# EAGLE design pixelinmyclosedetch (EAGLE 5.07)
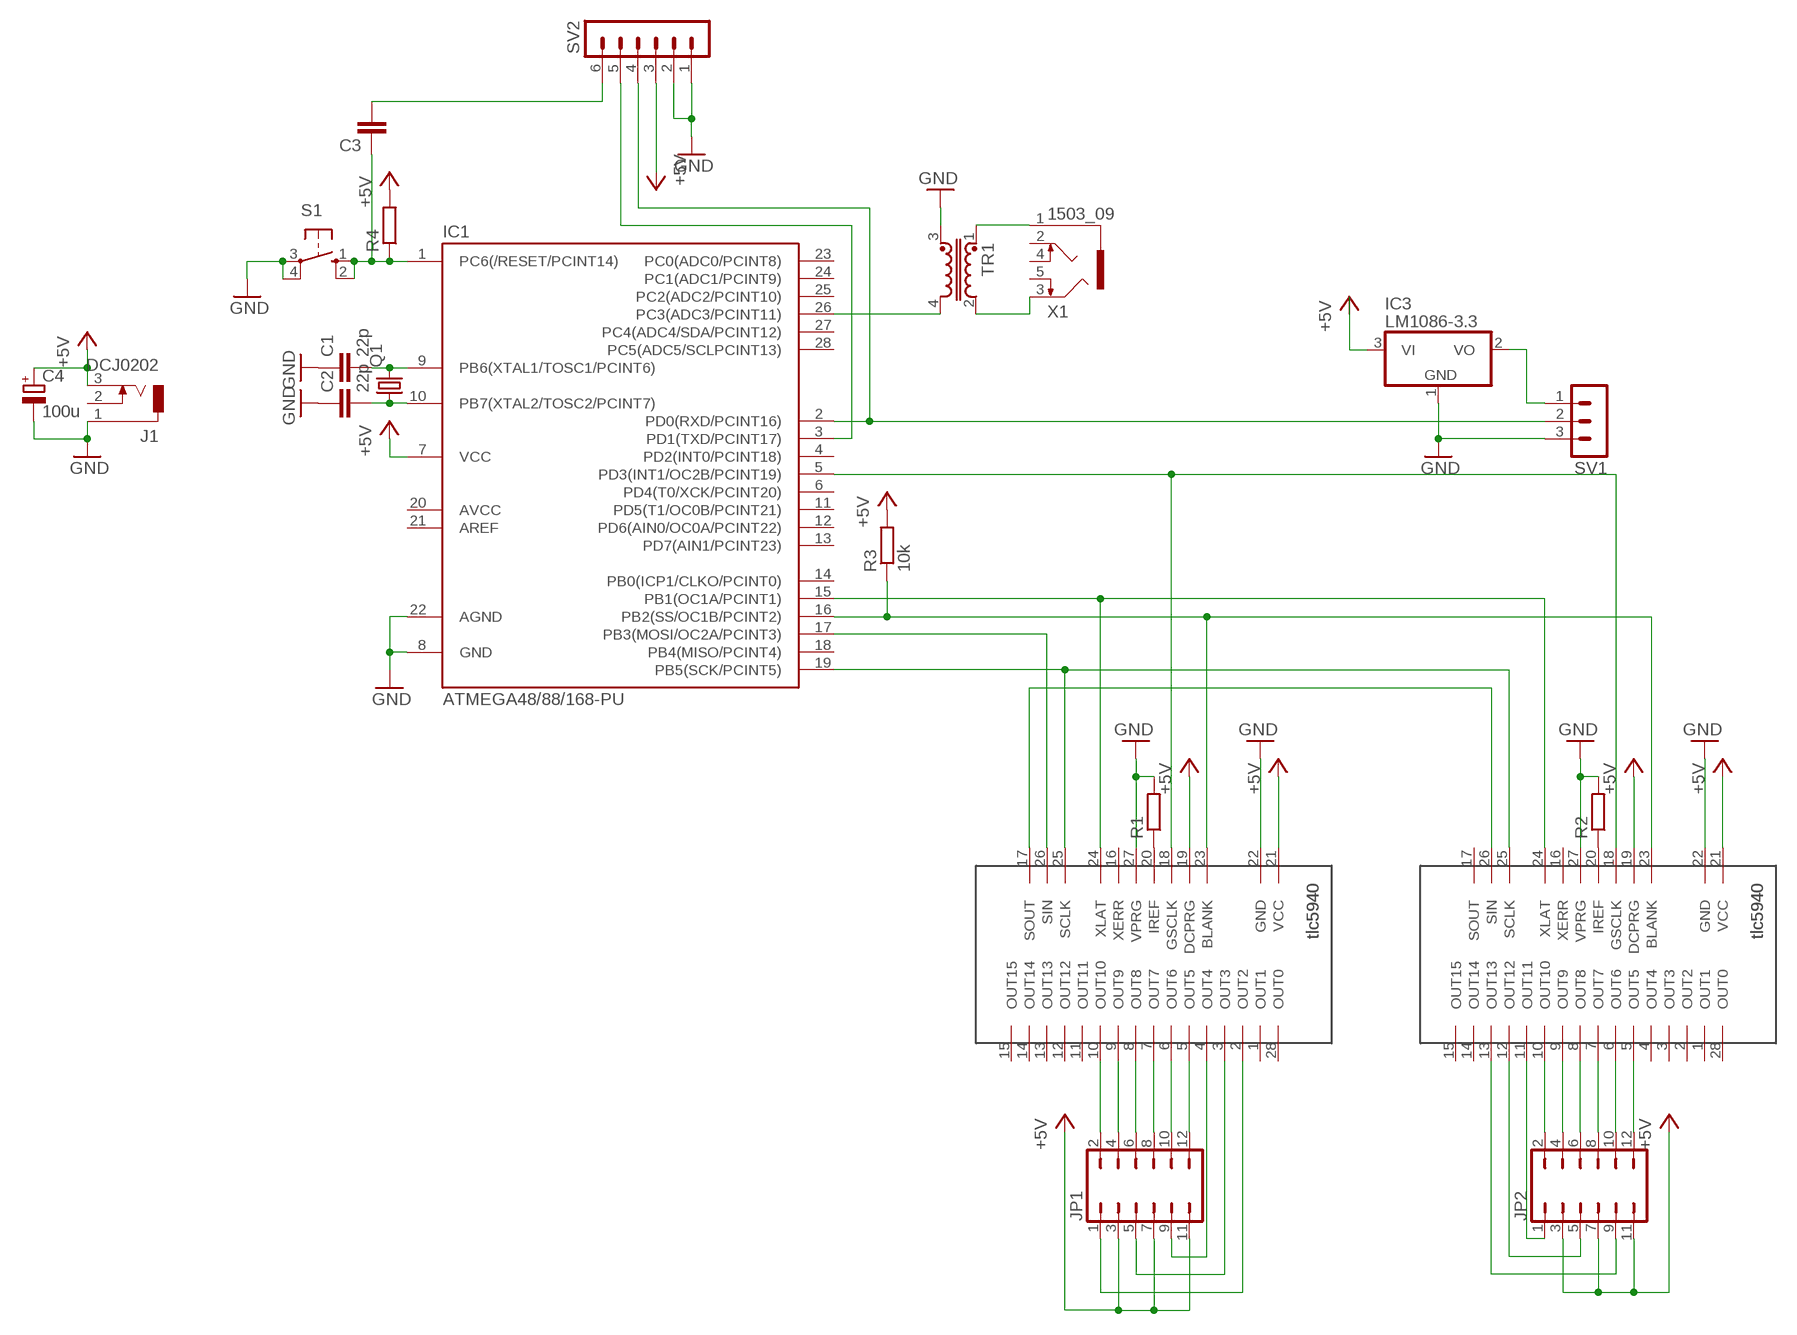
[diagram p0: schematic, sheet 1]

## Parts
C1  22p  C-EU025-025X050  [C025-025X050]
C2  22p  C-EU025-025X050  [C025-025X050]
C3  C-EU025-025X050  [C025-025X050]
C4  100u  CPOL-EUE2.5-7  [E2,5-7]
IC1  ATMEGA48/88/168-PU  [DIL28-3]
IC3  LM1086-3.3  [TO220V]
J1  DCJ0202  [DCJ0202]
JP1  JP6Q  [JP6Q]
JP2  JP6Q  [JP6Q]
Q1  CRYSTALHC18U-V  [HC18U-V]
R1  R-EU_0204/7  [0204/7]
R2  R-EU_0204/7  [0204/7]
R3  10k  R-EU_0204/7  [0204/7]
R4  R-EU_0204/7  [0204/7]
S1  10-XX  [B3F-10XX]
SV1  MA03-1  [MA03-1]
SV2  MA06-1  [MA06-1]
TR1  U15-TRANSFORMER  [U15]
U$1  TLC5940-NT  [28-DIL-300]
U$2  TLC5940-NT  [28-DIL-300]
X1  1503_09  [1503_09]

## Nets
+5V: C4.+ IC1.7(VCC) IC3.3(VI) J1.3 JP1.3 JP1.7 JP1.11 JP2.3 JP2.7 JP2.11 R3.2 R4.2 SV2.3 U$1.19(DCPRG) U$1.21(VCC) U$2.19(DCPRG) U$2.21(VCC)
GND: C1.1 C2.1 C4.- IC1.8(GND) IC1.22(AGND) IC3.1(GND) J1.1 R1.2 R2.2 S1.3(P) S1.4(P1) SV1.3 SV2.1 SV2.2 TR1.3 U$1.22(GND) U$1.27(VPRG) U$2.22(GND) U$2.27(VPRG)
N$1: C1.2 IC1.9(PB6(XTAL1/TOSC1/PCINT6)) Q1.2
N$2: C2.2 IC1.10(PB7(XTAL2/TOSC2/PCINT7)) Q1.1
N$3: IC1.17(PB3(MOSI/OC2A/PCINT3)) U$1.26(SIN)
N$4: IC1.19(PB5(SCK/PCINT5)) U$1.25(SCLK) U$2.25(SCLK)
N$5: IC1.16(PB2(SS/OC1B/PCINT2)) R3.1 U$1.23(BLANK) U$2.23(BLANK)
N$6: IC1.15(PB1(OC1A/PCINT1)) U$1.24(XLAT) U$2.24(XLAT)
N$7: U$1.17(SOUT) U$2.26(SIN)
N$8: IC1.5(PD3(INT1/OC2B/PCINT19)) U$1.18(GSCLK) U$2.18(GSCLK)
N$9: R1.1 U$1.20(IREF)
N$10: R2.1 U$2.20(IREF)
N$11: JP1.12 U$1.5(OUT5)
N$12: JP1.10 U$1.6(OUT6)
N$13: JP1.8 U$1.7(OUT7)
N$14: JP1.6 U$1.8(OUT8)
N$15: JP1.4 U$1.9(OUT9)
N$16: JP1.2 U$1.10(OUT10)
N$17: JP2.2 U$2.10(OUT10)
N$18: JP2.4 U$2.9(OUT9)
N$19: JP2.6 U$2.8(OUT8)
N$20: JP2.8 U$2.7(OUT7)
N$21: JP2.10 U$2.6(OUT6)
N$22: JP2.12 U$2.5(OUT5)
N$23: JP1.9 U$1.4(OUT4)
N$24: JP1.5 U$1.3(OUT3)
N$26: JP2.1 U$2.11(OUT11)
N$27: JP2.5 U$2.12(OUT12)
N$28: JP2.9 U$2.13(OUT13)
N$29: IC1.26(PC3(ADC3/PCINT11)) TR1.4
N$30: TR1.1 X1.1
N$31: TR1.2 X1.3
N$32: IC1.2(PD0(RXD/PCINT16)) SV1.2 SV2.4
N$33: IC3.2(VO) SV1.1
N$34: C3.1 IC1.1(PC6(/RESET/PCINT14)) R4.1 S1.1(S) S1.2(S1)
N$35: JP1.1 U$1.2(OUT2)
N$36: C3.2 SV2.6
N$38: IC1.3(PD1(TXD/PCINT17)) SV2.5
Unconnected: IC1.4(PD2(INT0/PCINT18)) IC1.6(PD4(T0/XCK/PCINT20)) IC1.11(PD5(T1/OC0B/PCINT21)) IC1.12(PD6(AIN0/OC0A/PCINT22)) IC1.13(PD7(AIN1/PCINT23)) IC1.14(PB0(ICP1/CLKO/PCINT0)) IC1.18(PB4(MISO/PCINT4)) IC1.20(AVCC) IC1.21(AREF) IC1.23(PC0(ADC0/PCINT8)) IC1.24(PC1(ADC1/PCINT9)) IC1.25(PC2(ADC2/PCINT10)) IC1.27(PC4(ADC4/SDA/PCINT12)) IC1.28(PC5(ADC5/SCLPCINT13)) J1.2 U$1.1(OUT1) U$1.11(OUT11) U$1.12(OUT12) U$1.13(OUT13) U$1.14(OUT14) U$1.15(OUT15) U$1.16(XERR) U$1.28(OUT0) U$2.1(OUT1) U$2.2(OUT2) U$2.3(OUT3) U$2.4(OUT4) U$2.14(OUT14) U$2.15(OUT15) U$2.16(XERR) U$2.17(SOUT) U$2.28(OUT0) X1.2 X1.4 X1.5

## Library data of the parts
C1-C3 = rcl:C-EU: CAPACITOR, European symbol
C4 = rcl:CPOL-EU: POLARIZED CAPACITOR, European symbol
IC1 = atmega8:ATMEGA48/88/168-PU
IC3 = oli:LM1086*: LM1086 1.5A Low Dropout Positive Regulators
J1 = con-jack:DCJ0202: DC POWER JACK Source: DCJ0202.pdf
JP1 JP2 = jumper:JP6Q: JUMPER
Q1 = crystal:CRYSTAL: CRYSTAL
R1-R4 = rcl:R-EU_: RESISTOR, European symbol
S1 = switch-omron:10-XX: OMRON SWITCH
SV1 = con-lstb:MA03-1: PIN HEADER
SV2 = con-lstb:MA06-1: PIN HEADER
TR1 = inductor-neosid:U15: TRANSFORMER U15
U$1 U$2 = TLC5490:TLC5940-NT
X1 = con-lumberg:1503_09: Jack connectors according to JISC 6560, 3.5 mm Klinkeneinbaukupplung nach JISC 6560, 3,5 mm, 3-polig/ stereo, abgewinkelte Ausführung, mit 2 Öffnern und Lötaugen, für Leiterplatten Rückseitenmontage Source: http://www.lumberg.com/Produkte/PDFs/1503_09.pdf

## Board
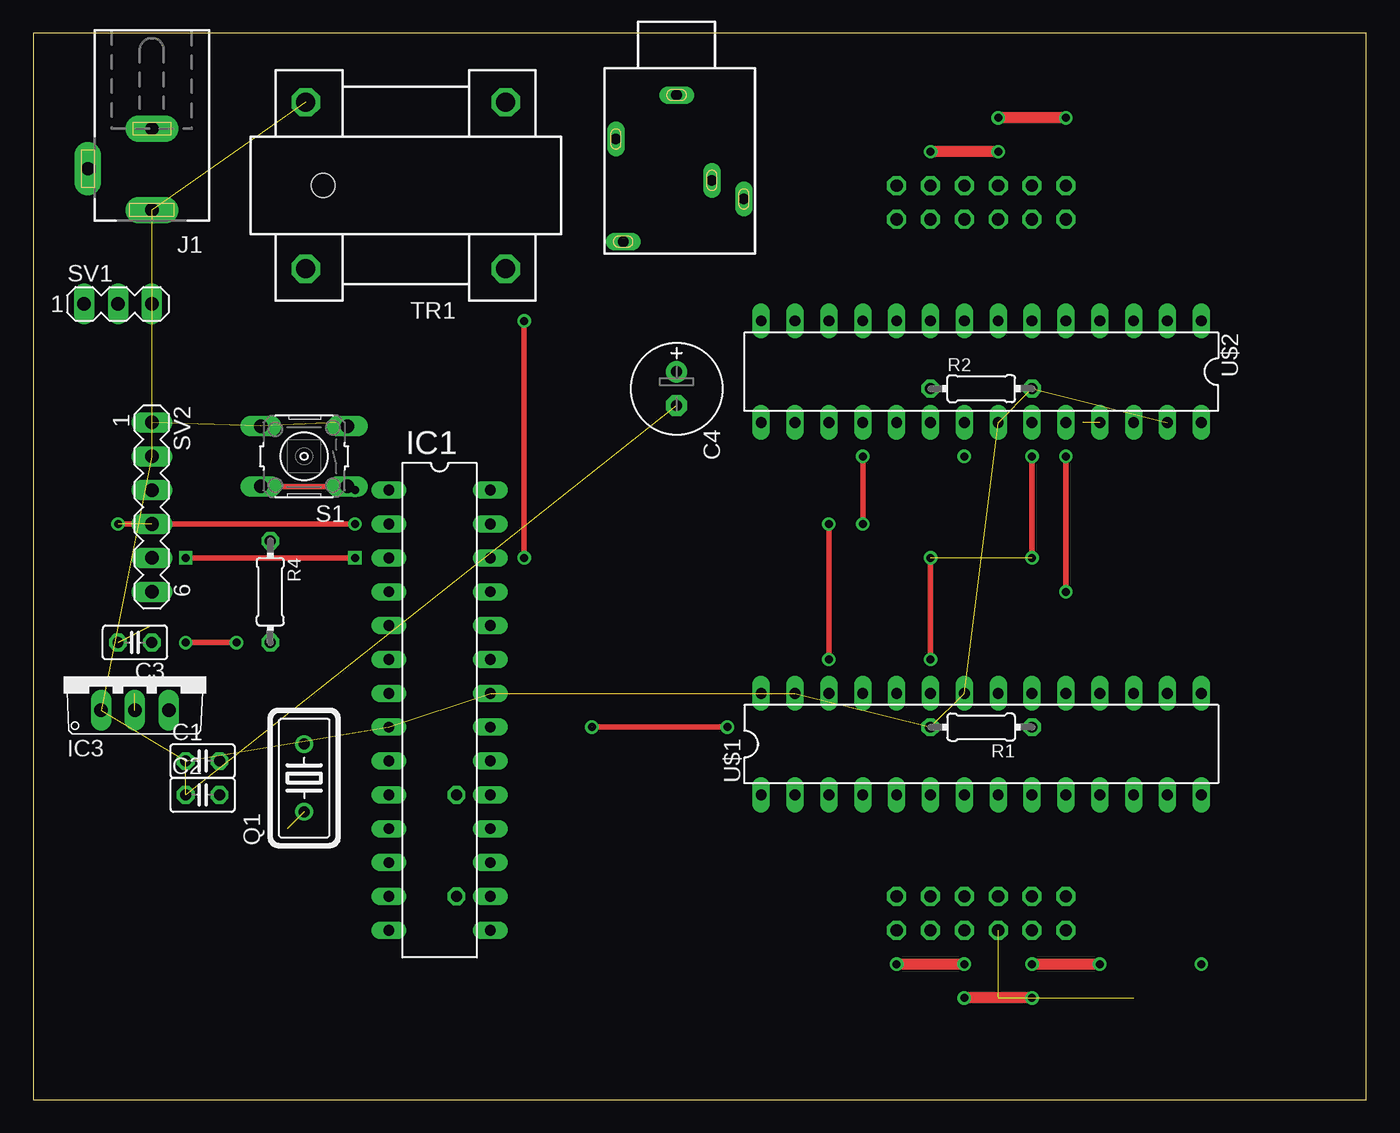
[diagram p1: board, top side]
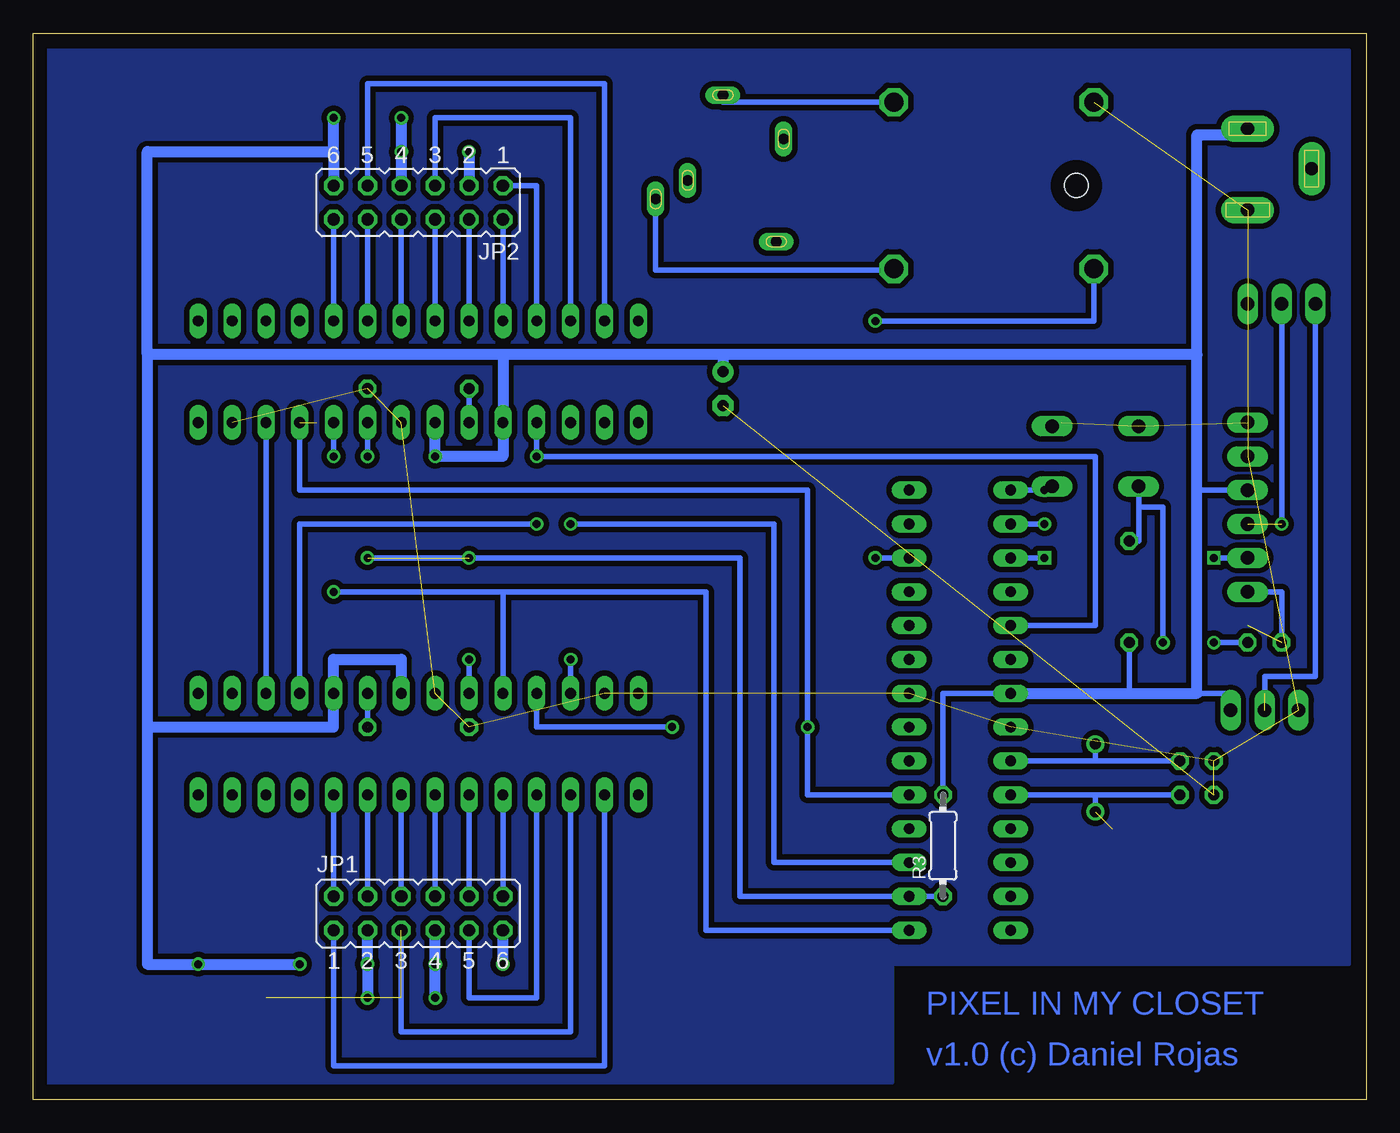
[diagram p2: board, bottom side, seen from below]

Size 100 x 80 mm. Coordinates in mm from the lower left corner, seen from the top.
Outline: 0,0 100,0 100,80 0,80 0,0
Copper layers (1*16): Top 0.035mm / dielectric 1.5mm / Bottom 0.035mm
Design rules "default": minimum track width 10mil, minimum drill 24mil, track to track 8mil, track to pad 8mil, pad to pad 8mil, via to via 8mil, smd to smd 8mil, copper to edge 40mil, drill to drill 8mil, minimum pad ring 10mil, minimum via ring 8mil, stop-mask expansion 4mil, vias tented up to drill 0mil, thermal gap 10mil

### Footprints (pad centres in the part's own frame; a part is rotated, then mirrored left to right if it is on the bottom)
C025-025X050 = drill 0.813 octagon: 1 -1.27,0; 2 1.27,0
E2,5-7 = drill 0.813 pad 1.6 round: + -1.27,0 | drill 0.813 pad 1.6 octagon: - 1.27,0
DIL28-3 = drill 0.813 long: 1 -16.51,-3.81; 2 -13.97,-3.81; 3 -11.43,-3.81; 4 -8.89,-3.81; 5 -6.35,-3.81; 6 -3.81,-3.81; 7 -1.27,-3.81; 8 1.27,-3.81; 9 3.81,-3.81; 10 6.35,-3.81; 11 8.89,-3.81; 12 11.43,-3.81; 13 13.97,-3.81; 14 16.51,-3.81; 15 16.51,3.81; 16 13.97,3.81; 17 11.43,3.81; 18 8.89,3.81; 19 6.35,3.81; 20 3.81,3.81; 21 1.27,3.81; 22 -1.27,3.81; 23 -3.81,3.81; 24 -6.35,3.81; 25 -8.89,3.81; 26 -11.43,3.81; 27 -13.97,3.81; 28 -16.51,3.81
TO220V = drill 1.016 long: 1 -2.54,-2.54; 2 0,-2.54; 3 2.54,-2.54
DCJ0202 = drill 1 pad 2 long: 1 0,3.1; 2 4.8,0; 3 0,-3
JP6Q = drill 0.914 octagon: 1 -6.35,-1.27; 2 -6.35,1.27; 3 -3.81,-1.27; 4 -3.81,1.27; 5 -1.27,-1.27; 6 -1.27,1.27; 7 1.27,-1.27; 8 1.27,1.27; 9 3.81,-1.27; 10 3.81,1.27; 11 6.35,-1.27; 12 6.35,1.27
HC18U-V = drill 0.813 round: 1 -2.54,0; 2 2.54,0
0204/7 = drill 0.813 octagon: 1 -3.81,0; 2 3.81,0
B3F-10XX = drill 1.016 long: 1 -3.251,2.261; 2 3.251,2.261; 3 -3.251,-2.261; 4 3.251,-2.261
MA03-1 = drill 1.016 long: 1 -2.54,0; 2 0,0; 3 2.54,0
MA06-1 = drill 1.016 long: 1 -6.35,0; 2 -3.81,0; 3 -1.27,0; 4 1.27,0; 5 3.81,0; 6 6.35,0
U15 = drill 1.422 octagon: 1 -7.5,-6.25; 2 -7.5,6.25; 3 7.5,-6.25; 4 7.5,6.25 | hole 1.8: 6.2,0
28-DIL-300 = drill 0.813 long: 1 -15.24,-3.81; 2 -12.7,-3.81; 3 -10.16,-3.81; 4 -7.62,-3.81; 5 -5.08,-3.81; 6 -2.54,-3.81; 7 0,-3.81; 8 2.54,-3.81; 9 5.08,-3.81; 10 7.62,-3.81; 11 10.16,-3.81; 12 12.7,-3.81; 13 15.24,-3.81; 14 17.78,-3.81; 15 17.78,3.81; 16 15.24,3.81; 17 12.7,3.81; 18 10.16,3.81; 19 7.62,3.81; 20 5.08,3.81; 21 2.54,3.81; 22 0,3.81; 23 -2.54,3.81; 24 -5.08,3.81; 25 -7.62,3.81; 26 -10.16,3.81; 27 -12.7,3.81; 28 -15.24,3.81
1503_09 = drill 0.8 pad 1.2 long: 1 0,-2.1; 2 -4.55,-5.4; 3 5.05,-9.9; 4 -4,-13.1; 5 2.65,-8.5

### Placement (x,y rotation side)
C1  12.7,25.4 0 top
C2  12.7,22.86 0 top
C3  7.62,34.29 180 top
C4  48.26,53.34 270 top
IC1  30.48,29.21 270 top
IC3  7.62,31.75 0 top
J1  8.89,69.85 180 top
JP1  71.12,13.97 0 bottom
JP2  71.12,67.31 180 bottom
Q1  20.32,24.13 90 top
R1  71.12,27.94 180 top
R2  71.12,53.34 0 top
R3  31.75,19.05 90 bottom
R4  17.78,38.1 270 top
S1  20.32,48.26 180 top
SV1  6.35,59.69 0 top
SV2  8.89,44.45 270 top
TR1  27.94,68.58 180 top
U$1  69.85,26.67 0 top
U$2  72.39,54.61 180 top
X1  48.26,77.47 0 top

### Tracks (layer width: path | path; a pad name or v marks a point on that pad's centre or on a via)
+5V  (via drill 0.6)
  Top 0.813: v69.85,10.16 v64.77,10.16 | v74.93,7.62 v69.85,7.62 | v80.01,10.16 v74.93,10.16 | v72.39,71.12 v67.31,71.12 | v77.47,73.66 v72.39,73.66
  Bottom 0.406: v87.63,10.16 85.09,10.16 | R3.2 31.75,30.48 29.21,30.48 IC1.7 10.16,30.48 IC3.3 | 17.78,30.48 R4.2 | 8.89,72.39 J1.3 | 12.7,45.72 SV2.3
  Bottom 0.813: v67.31,71.12 JP2.3 | JP2.7 v72.39,71.12 v72.39,73.66 | 77.47,71.12 JP2.11 | 77.47,71.12 91.44,71.12 91.44,55.88 | 91.44,27.94 91.44,10.16 v87.63,10.16 v80.01,10.16 | 91.44,55.88 91.44,27.94 | U$2.21 v69.85,48.26 64.77,48.26 U$2.19 64.77,55.88 | 64.77,55.88 91.44,55.88 | 91.44,27.94 77.47,27.94 U$1.19 77.47,33.02 72.39,33.02 U$1.21 | v64.77,10.16 JP1.11 | v69.85,7.62 v69.85,10.16 JP1.7 | v74.93,7.62 v74.93,10.16 JP1.3 | 77.47,71.12 v77.47,73.66 | IC1.7 17.78,30.48 12.7,30.48 12.7,45.72 12.7,55.88 | 12.7,55.88 48.26,55.88 | 48.26,55.88 64.77,55.88 | 8.89,72.39 12.7,72.39 12.7,55.88 | 48.26,55.88 C4.+
GND  (18 unrouted)
  Bottom 0.406: S1.3 23.57,50.8 22.86,50.8
N$1
  Bottom 0.406: 20.32,25.4 21.59,25.4 IC1.9 | 20.32,25.4 Q1.2 | C1.2 20.32,25.4
N$2  (1 unrouted)
  Bottom 0.406: 20.32,22.86 IC1.10 | C2.2 20.32,22.86 | 20.32,22.86 Q1.1
N$3  (via drill 0.6)
  Top 0.406: v59.69,43.18 v59.69,33.02
  Bottom 0.406: IC1.17 44.45,17.78 44.45,43.18 v59.69,43.18 | v59.69,33.02 U$1.26
N$4  (via drill 0.6)  (2 unrouted)
  Top 0.406: v41.91,27.94 v52.07,27.94
  Bottom 0.406: IC1.19 41.91,22.86 v41.91,27.94 41.91,45.72 80.01,45.72 U$2.25 | U$1.25 62.23,27.94 v52.07,27.94
N$5  (via drill 0.6)  (1 unrouted)
  Top 0.406: v74.93,40.64 v74.93,48.26 | v67.31,40.64 v67.31,33.02
  Bottom 0.406: v74.93,40.64 v67.31,40.64 46.99,40.64 46.99,15.24 IC1.16 R3.1 | v74.93,48.26 U$2.23 | v67.31,33.02 U$1.23
N$6  (via drill 0.6)
  Top 0.406: v77.47,38.1 v77.47,48.26
  Bottom 0.406: IC1.15 49.53,12.7 49.53,38.1 64.77,38.1 | 64.77,38.1 U$1.24 | 64.77,38.1 v77.47,38.1 | v77.47,48.26 U$2.24
N$7
  Bottom 0.406: U$1.17 U$2.26
N$8  (via drill 0.6)
  Top 0.406: v62.23,48.26 v62.23,43.18
  Bottom 0.406: U$1.18 80.01,43.18 v62.23,43.18 | U$2.18 v62.23,48.26 20.32,48.26 20.32,35.56 IC1.5
N$9  (1 unrouted)
  Bottom 0.406: R1.1 U$1.20
N$10
  Bottom 0.406: U$2.20 R2.1
N$11
  Bottom 0.406: JP1.12 U$1.5
N$12
  Bottom 0.406: JP1.10 U$1.6
N$13
  Bottom 0.406: JP1.8 U$1.7
N$14
  Bottom 0.406: JP1.6 U$1.8
N$15
  Bottom 0.406: JP1.4 U$1.9
N$16
  Bottom 0.406: JP1.2 U$1.10
N$17
  Bottom 0.406: U$2.10 JP2.2
N$18
  Bottom 0.406: U$2.9 JP2.4
N$19
  Bottom 0.406: U$2.8 JP2.6
N$20
  Bottom 0.406: U$2.7 JP2.8
N$21
  Bottom 0.406: U$2.6 JP2.10
N$22
  Bottom 0.406: U$2.5 JP2.12
N$23
  Bottom 0.406: U$1.4 62.23,7.62 67.31,7.62 JP1.9
N$24  (2 unrouted)
  Bottom 0.406: U$1.3 59.69,5.08 72.39,5.08 JP1.5
N$25
  pour Bottom (isolate 0.406): 1.27,78.74 99.06,78.74 99.06,1.27 35.56,1.27 35.56,8.89 35.56,10.16 1.27,10.16
N$26
  Bottom 0.406: JP2.1 62.23,68.58 U$2.11
N$27
  Bottom 0.406: U$2.12 59.69,73.66 69.85,73.66 JP2.5
N$28
  Bottom 0.406: U$2.13 57.15,76.2 74.93,76.2 JP2.9
N$29  (via drill 0.6)
  Top 0.406: v36.83,40.64 v36.83,58.42
  Bottom 0.406: IC1.26 v36.83,40.64 | v36.83,58.42 20.44,58.42 TR1.4
N$30
  Bottom 0.406: X1.1 48.26,74.83 TR1.1
N$31
  Bottom 0.406: X1.3 53.31,62.23 35.56,62.23 35.56,62.33 TR1.2
N$32  (via drill 0.6)  (1 unrouted)
  Top 0.406: v6.35,43.18 v24.13,43.18
  Bottom 0.406: v24.13,43.18 IC1.2 | v6.35,43.18 SV1.2
N$33  (1 unrouted)
  Bottom 0.406: SV1.1 3.81,31.75 7.62,31.75 IC3.2
N$34  (via drill 0.6)
  Top 0.406: v24.13,45.72 23.85,46 S1.2 | v11.43,34.29 v15.24,34.29
  Bottom 0.406: S1.1 23.57,45.72 v24.13,45.72 IC1.1 | 17.07,44.45 17.07,41.91 R4.1 | 17.07,44.45 S1.2 | C3.1 v11.43,34.29 | v15.24,34.29 15.24,44.45 17.07,44.45
N$35
  Bottom 0.406: U$1.2 57.15,2.54 77.47,2.54 JP1.1
N$36  (2 unrouted)
  Bottom 0.406: SV2.6 6.35,38.1 C3.2
N$38  (via drill 0.6)
  Top 0.406: v11.43,40.64 v24.13,40.64
  Bottom 0.406: SV2.5 v11.43,40.64 | v24.13,40.64 IC1.3

### Text on the board
Bottom: PIXEL IN MY CLOSET | v1.0 (c) Daniel Rojas